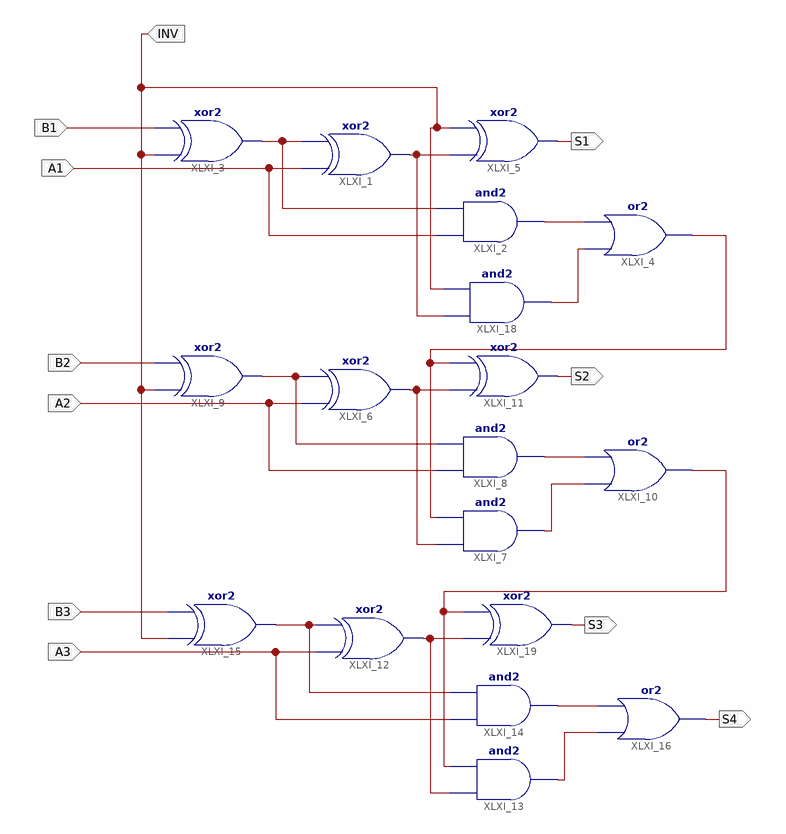
[diagram p0: schematic sheet 1]
// Xilinx ISE schematic Somador_Subtrator.sch (spartan3) as structural Verilog: 18 symbols, 11 ports
module Somador_Subtrator (
  input  A3,
  input  B3,
  input  A2,
  input  B2,
  input  B1,
  input  INV,
  input  A1,
  output S1,
  output S2,
  output S3,
  output S4
);

  wire XLXN_3, XLXN_5, XLXN_6, XLXN_7, XLXN_8, XLXN_10, XLXN_12, XLXN_13, XLXN_14, XLXN_15, XLXN_17, XLXN_19,
       XLXN_26, XLXN_38;

  xor XLXI_1 (XLXN_26, A1, XLXN_38);
  and XLXI_2 (XLXN_3, A1, XLXN_38);
  xor XLXI_3 (XLXN_38, INV, B1);
  or XLXI_4 (XLXN_12, XLXN_5, XLXN_3);
  xor XLXI_5 (S1, XLXN_26, INV);
  xor XLXI_6 (XLXN_7, A2, XLXN_6);
  and XLXI_7 (XLXN_10, XLXN_7, XLXN_12);
  and XLXI_8 (XLXN_8, A2, XLXN_6);
  xor XLXI_9 (XLXN_6, INV, B2);
  or XLXI_10 (XLXN_19, XLXN_10, XLXN_8);
  xor XLXI_11 (S2, XLXN_7, XLXN_12);
  xor XLXI_12 (XLXN_14, A3, XLXN_13);
  and XLXI_13 (XLXN_17, XLXN_14, XLXN_19);
  and XLXI_14 (XLXN_15, A3, XLXN_13);
  xor XLXI_15 (XLXN_13, INV, B3);
  or XLXI_16 (S4, XLXN_17, XLXN_15);
  xor XLXI_19 (S3, XLXN_14, XLXN_19);
  and XLXI_18 (XLXN_5, XLXN_26, INV);
endmodule
